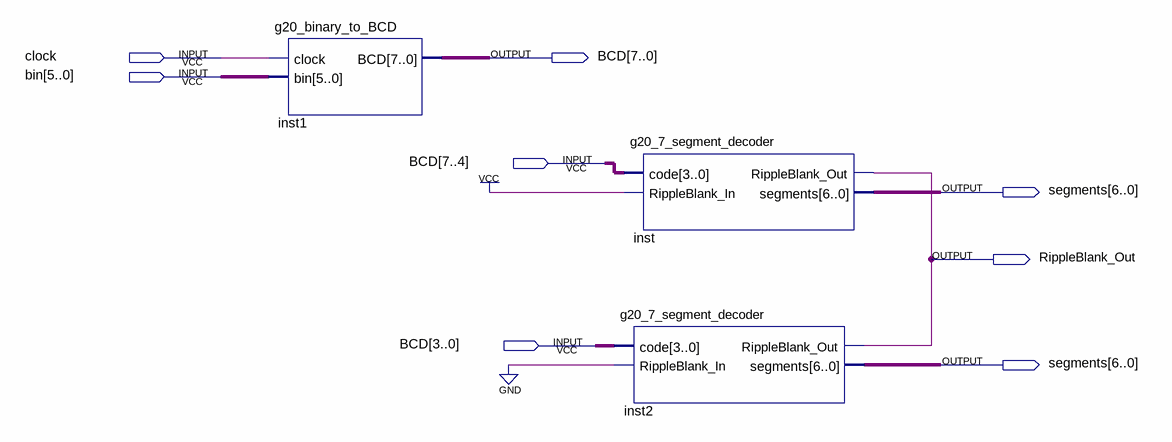
[diagram p0: schematic sheet]
// Quartus schematic Block2.bdf as structural Verilog: 3 symbols, 8 pins
module Block2 (
  input  clock,
  input  [5:0] bin,
  inout  [7:0] BCD,
  output [6:0] segments,
  output RippleBlank_Out
);

  g20_binary_to_BCD inst1 (.clock(clock), .bin(bin), .BCD(BCD));
  g20_7_segment_decoder inst2 (
    .code(BCD[3:0]), .RippleBlank_In(1'b0), .RippleBlank_Out(RippleBlank_Out), .segments(segments));
  g20_7_segment_decoder inst (
    .code(BCD[7:4]), .RippleBlank_In(1'b1), .RippleBlank_Out(RippleBlank_Out), .segments(segments));
endmodule
